# Altium schematic sheet 04_POWER.SchDoc: =title
size A3; Organization: 六零加智能科技; Address4: www.nidone.com.cn; DocumentNumber: kan jin; Revision: 1.0; SheetNumber: 4; SheetTotal: 23
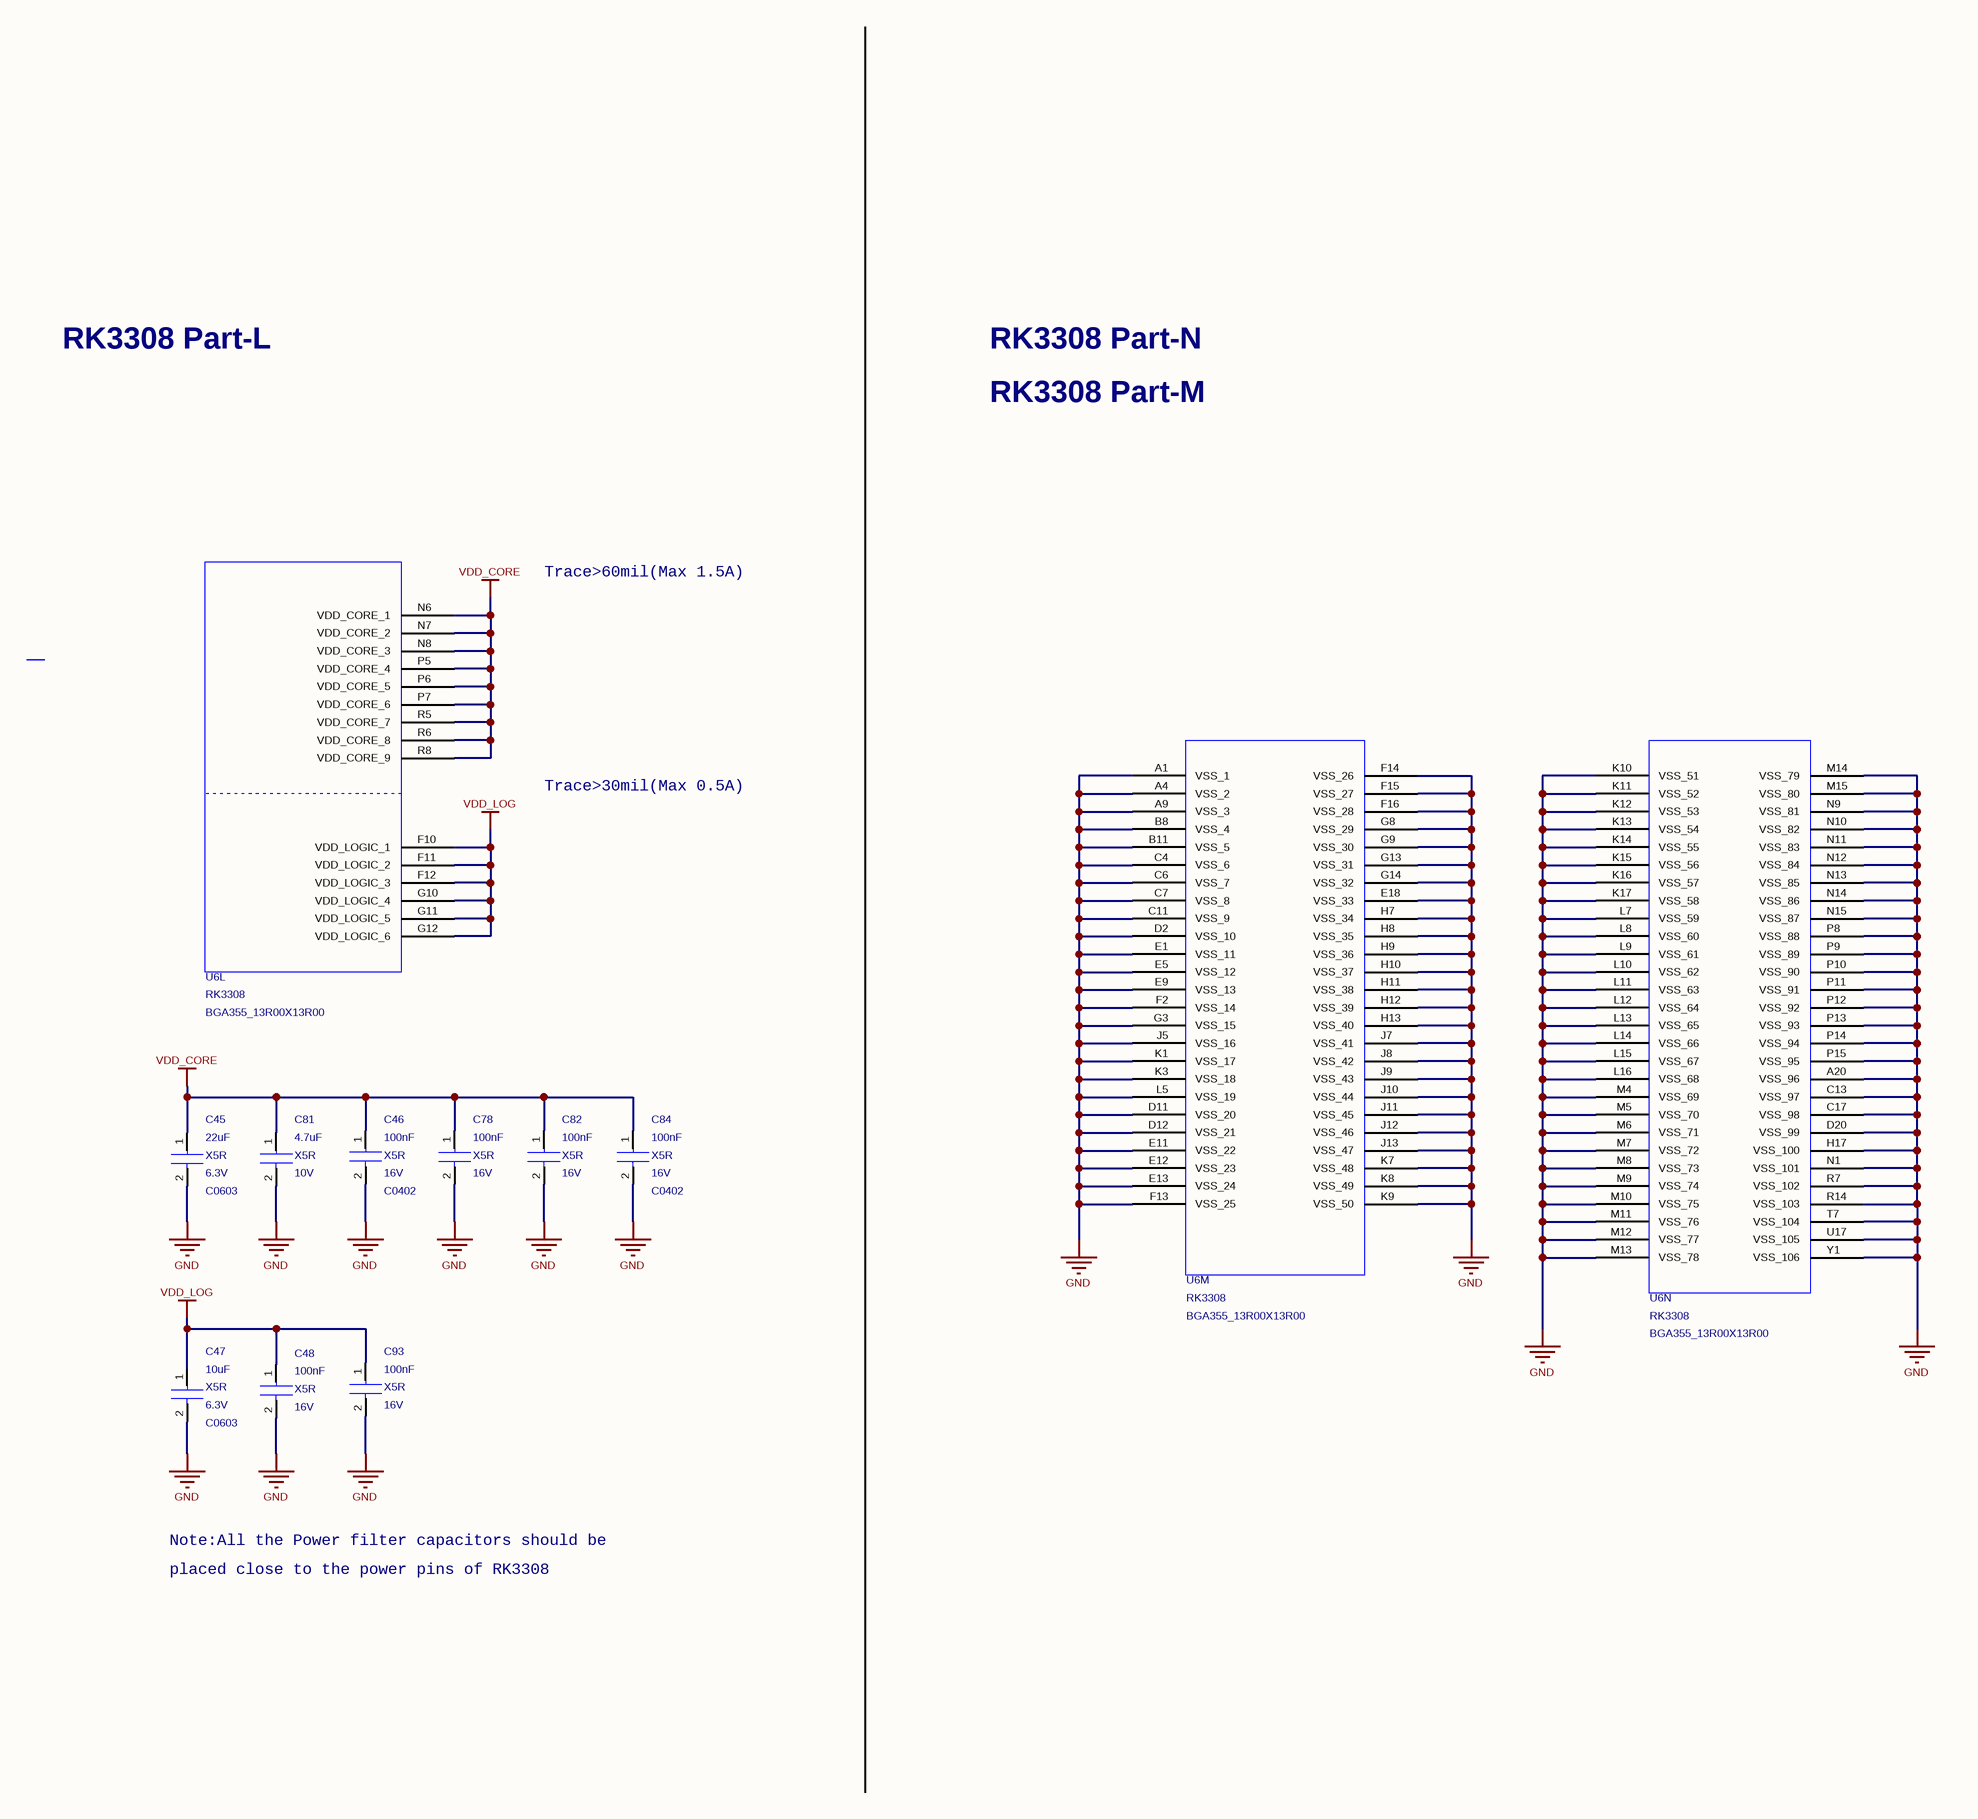
[diagram p0: 04_POWER.SchDoc]

## Parts
C45  value 22uF  Voltage: 6.3V  Dielectric: X5R  [C0603]  (hidden comment: CAP_NP_2)
C46  value 100nF  Voltage: 16V  Dielectric: X5R  [C0402]  (hidden comment: CAP_NP_2)
C47  value 10uF  Voltage: 6.3V  Dielectric: X5R  [C0603]  (hidden comment: CAP_NP_2)
C48  value 100nF  Dielectric: X5R  Voltage: 16V  [C0402]  (hidden comment: CAP_NP_2)
C78  value 100nF  Dielectric: X5R  Voltage: 16V  [C0402]  (hidden comment: CAP_NP_2)
C81  value 4.7uF  Dielectric: X5R  Voltage: 10V  [C0402]  (hidden comment: CAP_NP_2)
C82  value 100nF  Voltage: 16V  Dielectric: X5R  [C0402]  (hidden comment: CAP_NP_2)
C84  value 100nF  Dielectric: X5R  Voltage: 16V  [C0402]  (hidden comment: CAP_NP_2)
C93  value 100nF  Dielectric: X5R  Voltage: 16V  [C0402]  (hidden comment: CAP_NP_2)
U6  RK3308  [BGA355_13R00X13R00]  (parts L,M,N of 14)

## Nets
GND: C45.2 C46.2 C47.2 C48.2 C78.2 C81.2 C82.2 C84.2 C93.2 U6.A1(VSS_1) U6.A4(VSS_2) U6.A9(VSS_3) U6.A20(VSS_96) U6.B8(VSS_4) U6.B11(VSS_5) U6.C4(VSS_6) U6.C6(VSS_7) U6.C7(VSS_8) U6.C11(VSS_9) U6.C13(VSS_97) U6.C17(VSS_98) U6.D2(VSS_10) U6.D11(VSS_20) U6.D12(VSS_21) U6.D20(VSS_99) U6.E1(VSS_11) U6.E5(VSS_12) U6.E9(VSS_13) U6.E11(VSS_22) U6.E12(VSS_23) U6.E13(VSS_24) U6.E18(VSS_33) U6.F2(VSS_14) U6.F13(VSS_25) U6.F14(VSS_26) U6.F15(VSS_27) U6.F16(VSS_28) U6.G3(VSS_15) U6.G8(VSS_29) U6.G9(VSS_30) U6.G13(VSS_31) U6.G14(VSS_32) U6.H7(VSS_34) U6.H8(VSS_35) U6.H9(VSS_36) U6.H10(VSS_37) U6.H11(VSS_38) U6.H12(VSS_39) U6.H13(VSS_40) U6.H17(VSS_100) U6.J5(VSS_16) U6.J7(VSS_41) U6.J8(VSS_42) U6.J9(VSS_43) U6.J10(VSS_44) U6.J11(VSS_45) U6.J12(VSS_46) U6.J13(VSS_47) U6.K1(VSS_17) U6.K3(VSS_18) U6.K7(VSS_48) U6.K8(VSS_49) U6.K9(VSS_50) U6.K10(VSS_51) U6.K11(VSS_52) U6.K12(VSS_53) U6.K13(VSS_54) U6.K14(VSS_55) U6.K15(VSS_56) U6.K16(VSS_57) U6.K17(VSS_58) U6.L5(VSS_19) U6.L7(VSS_59) U6.L8(VSS_60) U6.L9(VSS_61) U6.L10(VSS_62) U6.L11(VSS_63) U6.L12(VSS_64) U6.L13(VSS_65) U6.L14(VSS_66) U6.L15(VSS_67) U6.L16(VSS_68) U6.M4(VSS_69) U6.M5(VSS_70) U6.M6(VSS_71) U6.M7(VSS_72) U6.M8(VSS_73) U6.M9(VSS_74) U6.M10(VSS_75) U6.M11(VSS_76) U6.M12(VSS_77) U6.M13(VSS_78) U6.M14(VSS_79) U6.M15(VSS_80) U6.N1(VSS_101) U6.N9(VSS_81) U6.N10(VSS_82) U6.N11(VSS_83) U6.N12(VSS_84) U6.N13(VSS_85) U6.N14(VSS_86) U6.N15(VSS_87) U6.P8(VSS_88) U6.P9(VSS_89) U6.P10(VSS_90) U6.P11(VSS_91) U6.P12(VSS_92) U6.P13(VSS_93) U6.P14(VSS_94) U6.P15(VSS_95) U6.R7(VSS_102) U6.R14(VSS_103) U6.T7(VSS_104) U6.U17(VSS_105) U6.Y1(VSS_106)
VDD_CORE: C45.1 C46.1 C78.1 C81.1 C82.1 C84.1 U6.N6(VDD_CORE_1) U6.N7(VDD_CORE_2) U6.N8(VDD_CORE_3) U6.P5(VDD_CORE_4) U6.P6(VDD_CORE_5) U6.P7(VDD_CORE_6) U6.R5(VDD_CORE_7) U6.R6(VDD_CORE_8) U6.R8(VDD_CORE_9)
VDD_LOG: C47.1 C48.1 C93.1 U6.F10(VDD_LOGIC_1) U6.F11(VDD_LOGIC_2) U6.F12(VDD_LOGIC_3) U6.G10(VDD_LOGIC_4) U6.G11(VDD_LOGIC_5) U6.G12(VDD_LOGIC_6)

## Notes on the sheet
- RK3308 Part-L
- RK3308 Part-N
- RK3308 Part-M
- Trace>60mil(Max 1.5A)
- Trace>30mil(Max 0.5A)
- Note:All the Power filter capacitors should be
- placed close to the power pins of RK3308
- Title
- Size:
- Date:
- A3
- Engineer:
- Time:
- Revision:
- Sheet
- of
- File:

## Library data of the parts
C45 = CAP_NP_2: cap,22.00uF,+/-20%,6.3V,X5R,C0603; Manufacturer_PN: C1608X5R0J226M080AC; Manufacturer: TDK; Created_by: JJJ; Tolerance: 20%; Priority: A; Source_Path: Z:\RK_STANDARD_LIBRARY\CADENCE_CIS\RK_DISCRETE.OLB; number: 1; PCB DECAL: C0603; Part_Type: C0603; RK_PN: C1608X5R0J226M080AC
C46 C82 = CAP_NP_2: cap,100.00nF,+/-10%,16V,X5R,C0402; Manufacturer_PN: C1005X5R1C104K050BA; Manufacturer: TDK; Created_by: JJJ; Tolerance: 10%; Priority: A; Source_Path: Z:\RK_STANDARD_LIBRARY\CADENCE_CIS\RK_DISCRETE.OLB; Number: 1; PCB DECAL: C0402; Part_Type: C0402; RK_PN: C1005X5R1C104K050BA
C47 = CAP_NP_2: cap,10.00uF,+/-10%,6.3V,X5R,C0603; Manufacturer_PN: C1608X5R0J106K080AB; Manufacturer: TDK; Created_by: JJJ; Tolerance: 10%; Priority: A; Source_Path: Z:\RK_STANDARD_LIBRARY\CADENCE_CIS\RK_DISCRETE.OLB; Number: 1; PCB DECAL: C0603; Part_Type: C0603; RK_PN: C1608X5R0J106K080AB; C_Voltage: 6.3V
C48 C78 C84 C93 = CAP_NP_2: cap,100.00nF,+/-10%,16V,X5R,C0402; Manufacturer: TDK; RK_PN: C1005X5R1C104K050BA; Priority: A; Tolerance: 10%; Created_by: JJJ; Source_Path: Z:\RK_STANDARD_LIBRARY\CADENCE_CIS\RK_DISCRETE.OLB; Number: 1; PCB DECAL: C0402; Part_Type: C0402; Manufacturer_PN: C1005X5R1C104K050BA
C81 = CAP_NP_2: cap,4.70uF,+/-10%,10V,X5R,C0402; Manufacturer: TDK; RK_PN: C1005X5R1A475K050BC; Priority: A; Tolerance: 10%; Created_by: JJJ; Source_Path: Z:\RK_STANDARD_LIBRARY\CADENCE_CIS\RK_DISCRETE.OLB; Number: 1; Part_Type: C0402; Manufacturer_PN: C1005X5R1A475K050BC; PCB DECAL: C0402
U6 = RK3308: Manufacturer: ROCKCHIP; Source_Path: E:\SCHEMETIC\RKSCH.OLB; Number: 1; PCB DECAL: BGA355_13R00X13R00; Value: RK3308; Manufacturer_PN: RK3308